# Altium schematic sheet Expansion Connector.SchDoc
size A4
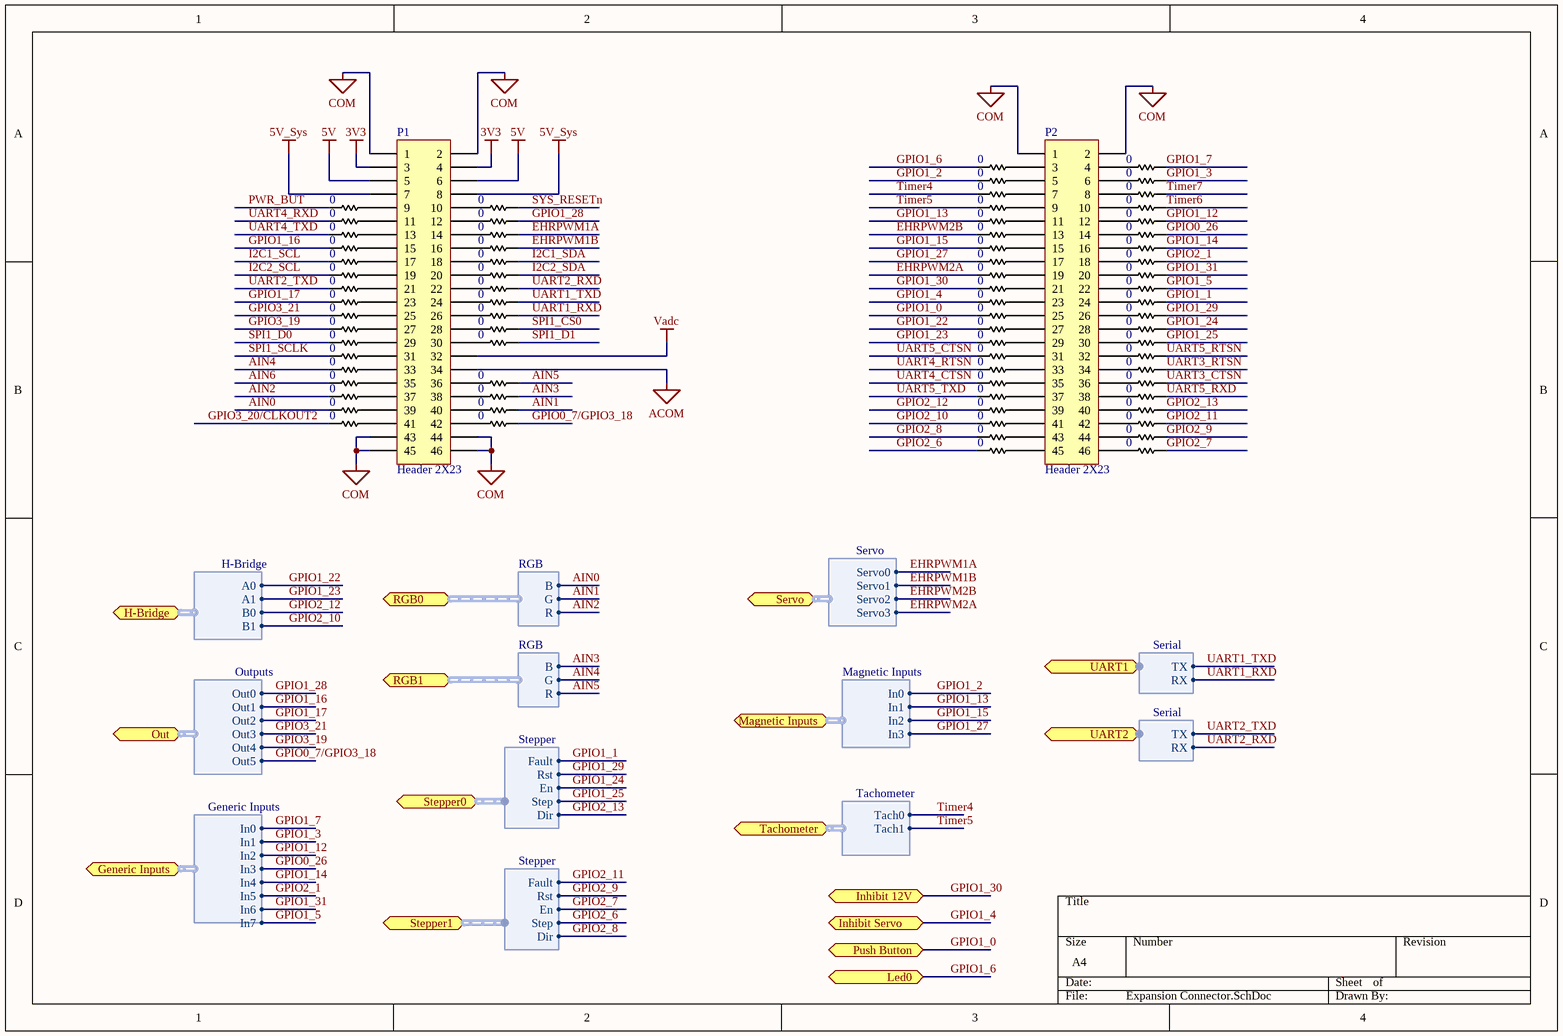
[diagram p0: Expansion Connector.SchDoc]

## Parts
J1  value 0  [0805 - Resistor]  (hidden comment: Res)
J2  value 0  [0805 - Resistor]  (hidden comment: Res)
J3  value 0  [0805 - Resistor]  (hidden comment: Res)
J4  value 0  [0805 - Resistor]  (hidden comment: Res)
J5  value 0  [0805 - Resistor]  (hidden comment: Res)
J6  value 0  [0805 - Resistor]  (hidden comment: Res)
J7  value 0  [0805 - Resistor]  (hidden comment: Res)
J8  value 0  [0805 - Resistor]  (hidden comment: Res)
J9  value 0  [0805 - Resistor]  (hidden comment: Res)
J10  value 0  [0805 - Resistor]  (hidden comment: Res)
J11  value 0  [0805 - Resistor]  (hidden comment: Res)
J12  value 0  [0805 - Resistor]  (hidden comment: Res)
J13  value 0  [0805 - Resistor]  (hidden comment: Res)
J14  value 0  [0805 - Resistor]  (hidden comment: Res)
J15  value 0  [0805 - Resistor]  (hidden comment: Res)
J16  value 0  [0805 - Resistor]  (hidden comment: Res)
J17  value 0  [0805 - Resistor]  (hidden comment: Res)
J18  value 0  [0805 - Resistor]  (hidden comment: Res)
J19  value 0  [0805 - Resistor]  (hidden comment: Res)
J20  value 0  [0805 - Resistor]  (hidden comment: Res)
J21  value 0  [0805 - Resistor]  (hidden comment: Res)
J22  value 0  [0805 - Resistor]  (hidden comment: Res)
J23  value 0  [0805 - Resistor]  (hidden comment: Res)
J24  value 0  [0805 - Resistor]  (hidden comment: Res)
J25  value 0  [0805 - Resistor]  (hidden comment: Res)
J26  value 0  [0805 - Resistor]  (hidden comment: Res)
J27  value 0  [0805 - Resistor]  (hidden comment: Res)
J28  value 0  [0805 - Resistor]  (hidden comment: Res)
J29  value 0  [0805 - Resistor]  (hidden comment: Res)
J30  value 0  [0805 - Resistor]  (hidden comment: Res)
J31  value 0  [0805 - Resistor]  (hidden comment: Res)
J32  value 0  [0805 - Resistor]  (hidden comment: Res)
J33  value 0  [0805 - Resistor]  (hidden comment: Res)
J34  value 0  [0805 - Resistor]  (hidden comment: Res)
J35  value 0  [0805 - Resistor]  (hidden comment: Res)
J36  value 0  [0805 - Resistor]  (hidden comment: Res)
J37  value 0  [0805 - Resistor]  (hidden comment: Res)
J38  value 0  [0805 - Resistor]  (hidden comment: Res)
J39  value 0  [0805 - Resistor]  (hidden comment: Res)
J40  value 0  [0805 - Resistor]  (hidden comment: Res)
J41  value 0  [0805 - Resistor]  (hidden comment: Res)
J42  value 0  [0805 - Resistor]  (hidden comment: Res)
J43  value 0  [0805 - Resistor]  (hidden comment: Res)
J44  value 0  [0805 - Resistor]  (hidden comment: Res)
J45  value 0  [0805 - Resistor]  (hidden comment: Res)
J46  value 0  [0805 - Resistor]  (hidden comment: Res)
J47  value 0  [0805 - Resistor]  (hidden comment: Res)
J48  value 0  [0805 - Resistor]  (hidden comment: Res)
J49  value 0  [0805 - Resistor]  (hidden comment: Res)
J50  value 0  [0805 - Resistor]  (hidden comment: Res)
J51  value 0  [0805 - Resistor]  (hidden comment: Res)
J52  value 0  [0805 - Resistor]  (hidden comment: Res)
J53  value 0  [0805 - Resistor]  (hidden comment: Res)
J54  value 0  [0805 - Resistor]  (hidden comment: Res)
J55  value 0  [0805 - Resistor]  (hidden comment: Res)
J56  value 0  [0805 - Resistor]  (hidden comment: Res)
J57  value 0  [0805 - Resistor]  (hidden comment: Res)
J58  value 0  [0805 - Resistor]  (hidden comment: Res)
J59  value 0  [0805 - Resistor]  (hidden comment: Res)
J60  value 0  [0805 - Resistor]  (hidden comment: Res)
J61  value 0  [0805 - Resistor]  (hidden comment: Res)
J62  value 0  [0805 - Resistor]  (hidden comment: Res)
J63  value 0  [0805 - Resistor]  (hidden comment: Res)
J64  value 0  [0805 - Resistor]  (hidden comment: Res)
J65  value 0  [0805 - Resistor]  (hidden comment: Res)
J66  value 0  [0805 - Resistor]  (hidden comment: Res)
J67  value 0  [0805 - Resistor]  (hidden comment: Res)
J68  value 0  [0805 - Resistor]  (hidden comment: Res)
J69  value 0  [0805 - Resistor]  (hidden comment: Res)
J70  value 0  [0805 - Resistor]  (hidden comment: Res)
J71  value 0  [0805 - Resistor]  (hidden comment: Res)
J72  value 0  [0805 - Resistor]  (hidden comment: Res)
J73  value 0  [0805 - Resistor]  (hidden comment: Res)
J74  value 0  [0805 - Resistor]  (hidden comment: Res)
J75  value 0  [0805 - Resistor]  (hidden comment: Res)
J76  value 0  [0805 - Resistor]  (hidden comment: Res)
P1  Header 2X23  [Headers - 2x23 - Bottom]
P2  Header 2X23  [Headers - 2x23 - Bottom]

## Ports
Generic Inputs (harness Generic Inputs), H-Bridge (harness H-Bridge), Inhibit 12V, Inhibit Servo, Led0, Magnetic Inputs (harness Magnetic Inputs), Out (harness Outputs), Push Button, RGB0 (harness RGB), RGB1 (harness RGB), Servo (harness Servo), Stepper0 (harness Stepper), Stepper1 (harness Stepper), Tachometer (harness Tachometer), UART1 (harness Serial), UART2 (harness Serial)

## Harnesses
Generic Inputs: In0, In1, In2, In3, In4, In5, In6, In7
Outputs: Out0, Out1, Out2, Out3, Out4, Out5
H-Bridge: A0, A1, B0, B1
RGB: R, G, B
Servo: Servo0, Servo1, Servo2, Servo3
Magnetic Inputs: In0, In1, In2, In3
Tachometer: Tach0, Tach1
Stepper: Dir, Step, En, Rst, Fault
Serial: TX, RX

## Nets
3V3: P1.3 P1.4
5V: P1.5 P1.6
5V_Sys: P1.7 P1.8
ACOM: P1.34
COM: P1.1 P1.2 P1.43 P1.44 P1.45 P1.46 P2.1 P2.2
Vadc: P1.32
AIN0: J65.2 ; port RGB0.B
AIN1: J66.1 ; port RGB0.G
AIN2: J61.2 ; port RGB0.R
AIN3: J62.1 ; port RGB1.B
AIN4: J54.2 ; port RGB1.G
AIN5: J58.1 ; port RGB1.R
AIN6: J57.2
EHRPWM1A: J16.1 ; port Servo.Servo0
EHRPWM1B: J20.1 ; port Servo.Servo1
EHRPWM2A: J29.2 ; port Servo.Servo3
EHRPWM2B: J17.2 ; port Servo.Servo2
GPIO0_7/GPIO3_18: J70.1 ; port Out.Out5
GPIO0_26: J18.1 ; port Generic Inputs.In3
GPIO1_0: J41.2 ; port Push Button
GPIO1_1: J38.1 ; port Stepper0.Fault
GPIO1_2: J3.2 ; port Magnetic Inputs.In0
GPIO1_3: J4.1 ; port Generic Inputs.In1
GPIO1_4: J37.2 ; port Inhibit Servo
GPIO1_5: J34.1 ; port Generic Inputs.In7
GPIO1_6: J1.2 ; port Led0
GPIO1_7: J2.1 ; port Generic Inputs.In0
GPIO1_12: J14.1 ; port Generic Inputs.In2
GPIO1_13: J13.2 ; port Magnetic Inputs.In1
GPIO1_14: J22.1 ; port Generic Inputs.In4
GPIO1_15: J21.2 ; port Magnetic Inputs.In2
GPIO1_16: J19.2 ; port Out.Out1
GPIO1_17: J35.2 ; port Out.Out2
GPIO1_22: J45.2 ; port H-Bridge.A0
GPIO1_23: J49.2 ; port H-Bridge.A1
GPIO1_24: J46.1 ; port Stepper0.En
GPIO1_25: J50.1 ; port Stepper0.Step
GPIO1_27: J25.2 ; port Magnetic Inputs.In3
GPIO1_28: J12.1 ; port Out.Out0
GPIO1_29: J42.1 ; port Stepper0.Rst
GPIO1_30: J33.2 ; port Inhibit 12V
GPIO1_31: J30.1 ; port Generic Inputs.In6
GPIO2_1: J26.1 ; port Generic Inputs.In5
GPIO2_6: J75.2 ; port Stepper1.Step
GPIO2_7: J76.1 ; port Stepper1.En
GPIO2_8: J73.2 ; port Stepper1.Dir
GPIO2_9: J74.1 ; port Stepper1.Rst
GPIO2_10: J71.2 ; port H-Bridge.B1
GPIO2_11: J72.1 ; port Stepper1.Fault
GPIO2_12: J67.2 ; port H-Bridge.B0
GPIO2_13: J68.1 ; port Stepper0.Dir
GPIO3_19: J43.2 ; port Out.Out4
GPIO3_20/CLKOUT2: J69.2
GPIO3_21: J39.2 ; port Out.Out3
I2C1_SCL: J23.2
I2C1_SDA: J24.1
I2C2_SCL: J27.2
I2C2_SDA: J28.1
PWR_BUT: J7.2
SPI1_CS0: J44.1
SPI1_D0: J47.2
SPI1_D1: J48.1
SPI1_SCLK: J51.2
SYS_RESETn: J8.1
Timer4: J5.2 ; port Tachometer.Tach0
Timer5: J9.2 ; port Tachometer.Tach1
Timer6: J10.1
Timer7: J6.1
UART1_RXD: J40.1 ; port UART1.RX
UART1_TXD: J36.1 ; port UART1.TX
UART2_RXD: J32.1 ; port UART2.RX
UART2_TXD: J31.2 ; port UART2.TX
UART3_CTSN: J60.1
UART3_RTSN: J56.1
UART4_CTSN: J59.2
UART4_RTSN: J55.2
UART4_RXD: J11.2
UART4_TXD: J15.2
UART5_CTSN: J52.2
UART5_RTSN: J53.1
UART5_RXD: J64.1
UART5_TXD: J63.2
NetJ1_1: J1.1 P2.3
NetJ2_2: J2.2 P2.4
NetJ3_1: J3.1 P2.5
NetJ4_2: J4.2 P2.6
NetJ5_1: J5.1 P2.7
NetJ6_2: J6.2 P2.8
NetJ7_1: J7.1 P1.9
NetJ8_2: J8.2 P1.10
NetJ9_1: J9.1 P2.9
NetJ10_2: J10.2 P2.10
NetJ11_1: J11.1 P1.11
NetJ12_2: J12.2 P1.12
NetJ13_1: J13.1 P2.11
NetJ14_2: J14.2 P2.12
NetJ15_1: J15.1 P1.13
NetJ16_2: J16.2 P1.14
NetJ17_1: J17.1 P2.13
NetJ18_2: J18.2 P2.14
NetJ19_1: J19.1 P1.15
NetJ20_2: J20.2 P1.16
NetJ21_1: J21.1 P2.15
NetJ22_2: J22.2 P2.16
NetJ23_1: J23.1 P1.17
NetJ24_2: J24.2 P1.18
NetJ25_1: J25.1 P2.17
NetJ26_2: J26.2 P2.18
NetJ27_1: J27.1 P1.19
NetJ28_2: J28.2 P1.20
NetJ29_1: J29.1 P2.19
NetJ30_2: J30.2 P2.20
NetJ31_1: J31.1 P1.21
NetJ32_2: J32.2 P1.22
NetJ33_1: J33.1 P2.21
NetJ34_2: J34.2 P2.22
NetJ35_1: J35.1 P1.23
NetJ36_2: J36.2 P1.24
NetJ37_1: J37.1 P2.23
NetJ38_2: J38.2 P2.24
NetJ39_1: J39.1 P1.25
NetJ40_2: J40.2 P1.26
NetJ41_1: J41.1 P2.25
NetJ42_2: J42.2 P2.26
NetJ43_1: J43.1 P1.27
NetJ44_2: J44.2 P1.28
NetJ45_1: J45.1 P2.27
NetJ46_2: J46.2 P2.28
NetJ47_1: J47.1 P1.29
NetJ48_2: J48.2 P1.30
NetJ49_1: J49.1 P2.29
NetJ50_2: J50.2 P2.30
NetJ51_1: J51.1 P1.31
NetJ52_1: J52.1 P2.31
NetJ53_2: J53.2 P2.32
NetJ54_1: J54.1 P1.33
NetJ55_1: J55.1 P2.33
NetJ56_2: J56.2 P2.34
NetJ57_1: J57.1 P1.35
NetJ58_2: J58.2 P1.36
NetJ59_1: J59.1 P2.35
NetJ60_2: J60.2 P2.36
NetJ61_1: J61.1 P1.37
NetJ62_2: J62.2 P1.38
NetJ63_1: J63.1 P2.37
NetJ64_2: J64.2 P2.38
NetJ65_1: J65.1 P1.39
NetJ66_2: J66.2 P1.40
NetJ67_1: J67.1 P2.39
NetJ68_2: J68.2 P2.40
NetJ69_1: J69.1 P1.41
NetJ70_2: J70.2 P1.42
NetJ71_1: J71.1 P2.41
NetJ72_2: J72.2 P2.42
NetJ73_1: J73.1 P2.43
NetJ74_2: J74.2 P2.44
NetJ75_1: J75.1 P2.45
NetJ76_2: J76.2 P2.46

## Library data of the parts
J1-J76 = Jumper-0805: RES 0.0 OHM 1/8W JUMP 0805; Manufacturer: Stackpole electronic; Manufacturer No: RMCF0805ZT0R00; Sub Category: 0805; Current: 2A; Part Number: Jumper-0805; Category: Resistor; Pin count: 2; Package: 0805; Series: RMFC; Supplier 1: Digi-Key; Supplier Part Number 1: RMCF0805ZT0R00CT-ND; ComponentLink1URL: http://www.seielect.com/Catalog/SEI-RMCF_RMCP.pdf; ComponentLink1Description: Datasheet; Creation Date: 2013-09-21 02:33:24; Created by: Pier-Yves; Power: 1/8W; Height: 0.65mm
P1 P2 = Header-0.100-Generic-2x23: Sub Category: 100mils Vertical Generic; Part Number: Header-0.100-Generic-2x23; Category: Header; Pin count: 46; Package: THT; Manufacturer: Generic; Manufacturer No: -; Series: -; Supplier 1: -; Created by: Pier-Yves